# Altium schematic sheet JTAG.SchDoc
size A
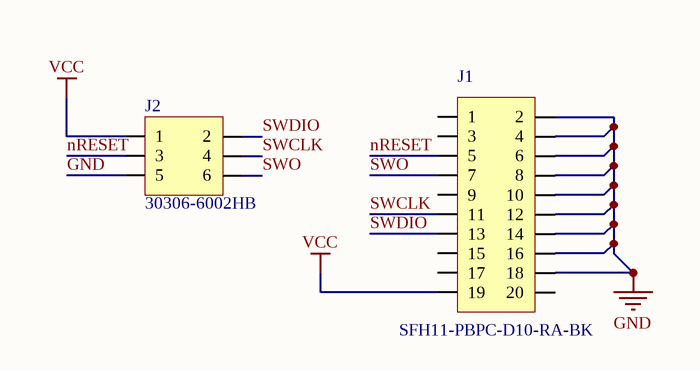
[diagram p0: JTAG.SchDoc]

## Parts
J1  SFH11-PBPC-D10-RA-BK  [SFH11-PBPC-D10-RA-BK]
J2  30306-6002HB  [30306-6002HB]

## Nets
GND: J1.2 J1.4 J1.6 J1.8 J1.10 J1.12 J1.14 J1.16 J1.18 J2.5
VCC: J1.19 J2.1
nRESET: J1.5 J2.3
SWCLK: J1.11 J2.4
SWDIO: J1.13 J2.2
SWO: J1.7 J2.6

Not connected (* = marked no-connect by the designer): J1 1 3 9 15 17 20

## Library data of the parts
J1 = SFH11-PBPC-D10-RA-BK: 20 Position Header Connector 0.100" (2.54mm) Through Hole, Right Angle Gold; Manufacturer: Sullins Connector Solutions; Manufacturer Part Number: SFH11-PBPC-D10-RA-BK
J2 = 30306-6002HB: 6 Positions Header Connector 0.100" (2.54mm) Through Hole Gold; Manufacturer: 3M; Manufacturer Part Number: 30306-6002HB